# Altium project jtag-isolator.PrjPcb
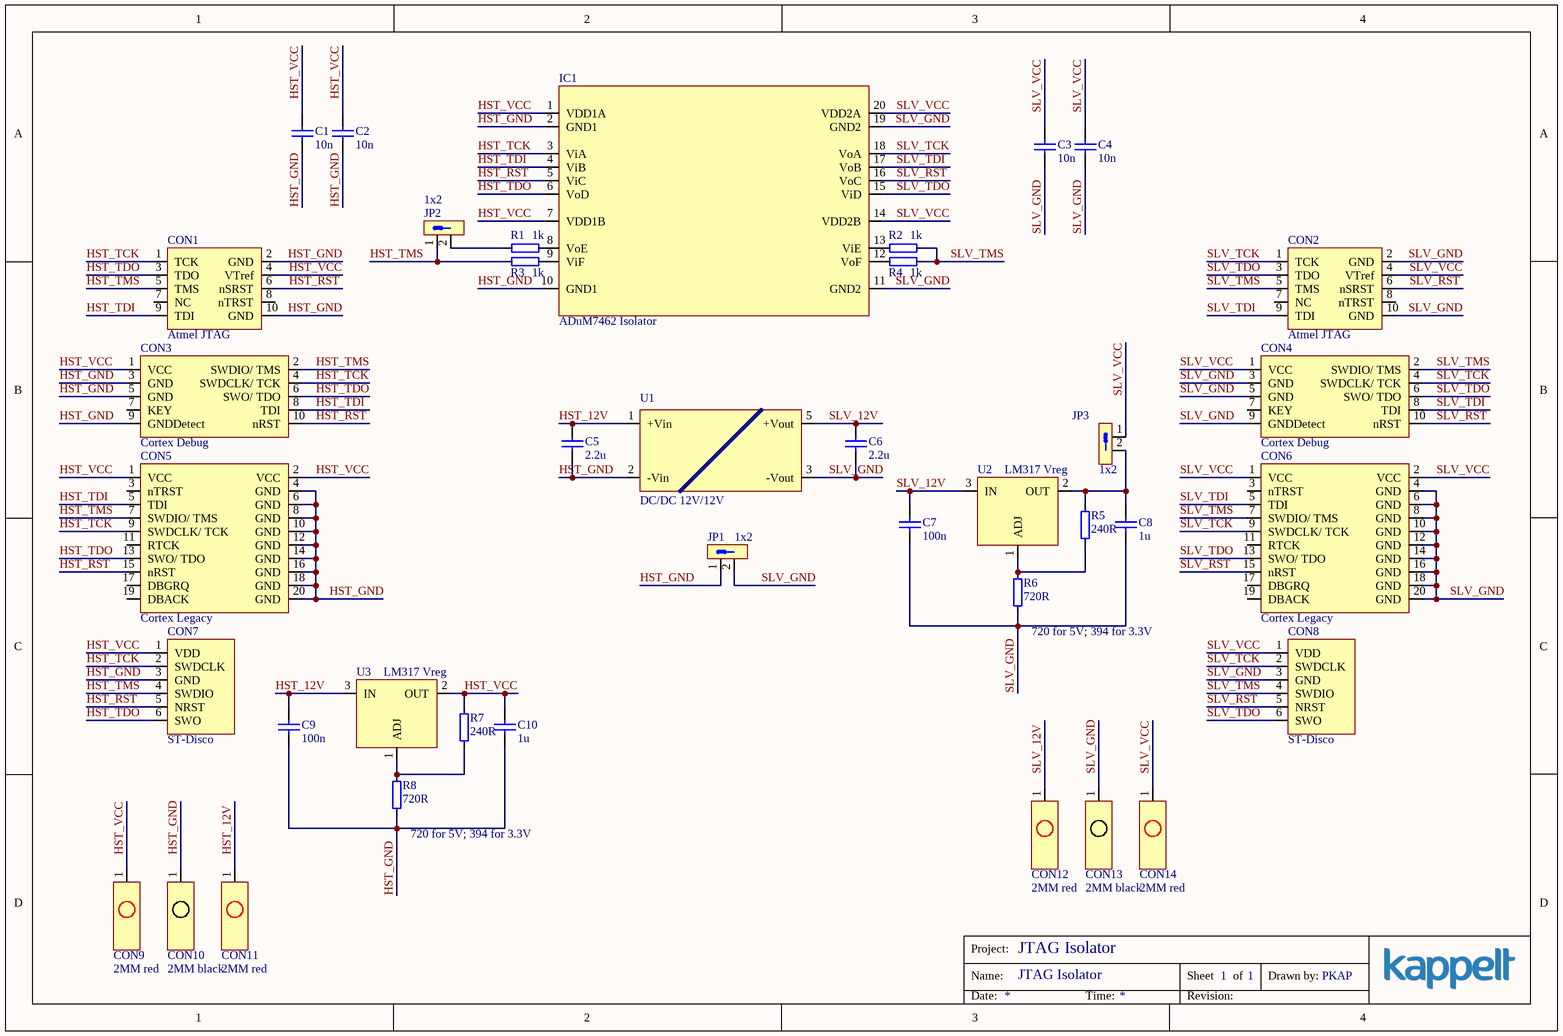
[diagram p0: jtag-isolator.SchDoc]
ProjectName: JTAG Isolator
1 sheet, 39 parts. Net scope: global (net labels, ports and power ports of the same name join across sheets).
Board file: jtag-isolator.PcbDoc

## Sheet jtag-isolator.SchDoc
size A4; DrawnBy: PKAP; SheetNumber: 1; SheetTotal: 1; DocumentName: JTAG Isolator; ProjectName: JTAG Isolator

### Parts
C1  10n  [0603_N]
C2  10n  [0603_N]
C3  10n  [0603_N]
C4  10n  [0603_N]
C5  2.2u  [0603_N]
C6  2.2u  [0603_N]
C7  100n  [0603_N]
C8  1u  [0603_N]
C9  100n  [0603_N]
C10  1u  [0603_N]
CON1  Atmel JTAG  [Atmel-JTAG]
CON2  Atmel JTAG  [Atmel-JTAG]
CON3  Cortex Debug  [cortex-dbg]
CON4  Cortex Debug  [cortex-dbg]
CON5  Cortex Legacy  [Cortex-Legacy]
CON6  Cortex Legacy  [Cortex-Legacy]
CON7  ST-Disco  [ST-Disco]
CON8  ST-Disco  [ST-Disco]
CON9  2MM red  [MPB1-Red]
CON10  2MM black  [MPB1-Black]
CON11  2MM red  [MPB1-Red]
CON12  2MM red  [MPB1-Red]
CON13  2MM black  [MPB1-Black]
CON14  2MM red  [MPB1-Red]
IC1  ADuM7462 Isolator  [ADUM7462-QSOP20]
JP1  1x2  [Header_254_1x2_male]
JP2  1x2  [Header_254_1x2_male]
JP3  1x2  [Header_254_1x2_male]
R1  1k  [0603_N]
R2  1k  [0603_N]
R3  1k  [0603_N]
R4  1k  [0603_N]
R5  240R  [0603_N]
R6  720R  [0603_N]
R7  240R  [0603_N]
R8  720R  [0603_N]
U1  DC/DC 12V/12V  [TMA-1212S]
U2  LM317 Vreg  [LM317-SOT223]
U3  LM317 Vreg  [LM317-SOT223]

### Nets
HST_12V: C5.2 C9.2 CON11.1 U1.1(+Vin) U3.3(IN)
HST_GND: C1.1 C2.1 C5.1 C9.1 C10.1 CON1.2(GND) CON1.10(GND) CON3.3(GND) CON3.5(GND) CON3.9(GNDDetect) CON5.4(GND) CON5.6(GND) CON5.8(GND) CON5.10(GND) CON5.12(GND) CON5.14(GND) CON5.16(GND) CON5.18(GND) CON5.20(GND) CON7.3(GND) CON10.1 IC1.2(GND1) IC1.10(GND1) JP1.1 R8.2 U1.2(-Vin)
HST_RST: CON1.6(nSRST) CON3.10(nRST) CON5.15(nRST) CON7.5(NRST) IC1.5(ViC)
HST_TCK: CON1.1(TCK) CON3.4(SWDCLK/_TCK) CON5.9(SWDCLK/_TCK) CON7.2(SWDCLK) IC1.3(ViA)
HST_TDI: CON1.9(TDI) CON3.8(TDI) CON5.5(TDI) IC1.4(ViB)
HST_TDO: CON1.3(TDO) CON3.6(SWO/_TDO) CON5.13(SWO/_TDO) CON7.6(SWO) IC1.6(VoD)
HST_TMS: CON1.5(TMS) CON3.2(SWDIO/_TMS) CON5.7(SWDIO/_TMS) CON7.4(SWDIO) JP2.1 R3.2
HST_VCC: C1.2 C2.2 C10.2 CON1.4(VTref) CON3.1(VCC) CON5.1(VCC) CON5.2(VCC) CON7.1(VDD) CON9.1 IC1.1(VDD1A) IC1.7(VDD1B) R7.1 U3.2(OUT)
SLV_12V: C6.2 C7.2 CON12.1 U1.5(+Vout) U2.3(IN)
SLV_GND: C3.1 C4.1 C6.1 C7.1 C8.1 CON2.2(GND) CON2.10(GND) CON4.3(GND) CON4.5(GND) CON4.9(GNDDetect) CON6.4(GND) CON6.6(GND) CON6.8(GND) CON6.10(GND) CON6.12(GND) CON6.14(GND) CON6.16(GND) CON6.18(GND) CON6.20(GND) CON8.3(GND) CON13.1 IC1.11(GND2) IC1.19(GND2) JP1.2 R6.2 U1.3(-Vout)
SLV_RST: CON2.6(nSRST) CON4.10(nRST) CON6.15(nRST) CON8.5(NRST) IC1.16(VoC)
SLV_TCK: CON2.1(TCK) CON4.4(SWDCLK/_TCK) CON6.9(SWDCLK/_TCK) CON8.2(SWDCLK) IC1.18(VoA)
SLV_TDI: CON2.9(TDI) CON4.8(TDI) CON6.5(TDI) IC1.17(VoB)
SLV_TDO: CON2.3(TDO) CON4.6(SWO/_TDO) CON6.13(SWO/_TDO) CON8.6(SWO) IC1.15(ViD)
SLV_TMS: CON2.5(TMS) CON4.2(SWDIO/_TMS) CON6.7(SWDIO/_TMS) CON8.4(SWDIO) R2.1 R4.1
SLV_VCC: C3.2 C4.2 CON2.4(VTref) CON4.1(VCC) CON6.1(VCC) CON6.2(VCC) CON8.1(VDD) CON14.1 IC1.14(VDD2B) IC1.20(VDD2A) JP3.1
NetC8_2: C8.2 JP3.2 R5.1 U2.2(OUT)
NetIC1_8: IC1.8(VoE) R1.1
NetIC1_9: IC1.9(ViF) R3.1
NetIC1_12: IC1.12(VoF) R4.2
NetIC1_13: IC1.13(ViE) R2.2
NetJP2_2: JP2.2 R1.2
NetR5_2: R5.2 R6.1 U2.1(ADJ)
NetR7_2: R7.2 R8.1 U3.1(ADJ)

Not connected (* = marked no-connect by the designer): CON1 7(NC) 8(nTRST); CON2 7(NC) 8(nTRST); CON3 7(KEY); CON4 7(KEY); CON5 3(nTRST) 11(RTCK) 17(DBGRQ) 19(DBACK); CON6 3(nTRST) 11(RTCK) 17(DBGRQ) 19(DBACK)

### Notes on the sheet
- (near R6) 720 for 5V; 394 for 3.3V
- (near R8) 720 for 5V; 394 for 3.3V
- Project:
- Name:
- Sheet
- of
- Drawn by:
- Date:
- Time:
- Revision:

### Library data of the parts
C1-C4 = 10n_50V_0603: 10n 50V 0603; part_id: 1100021; MID: std; accuracy: 10.00%; Part Number: 10n_50V_0603; Category: _0603; Sch_Comment: 10n; PID: std; Value: 10n; voltage_rate: 50V
C5 C6 = 2u2_25V_0603: 2u2 25V 0603; part_id: 1100032; MID: std; accuracy: 10.00%; Part Number: 2u2_25V_0603; Category: _0603; Sch_Comment: 2.2u; PID: std; Value: 2.2u; voltage_rate: 25V
C7 C9 = 100n_50V_0603: 100n 50V 0603; part_id: 1100026; MID: std; accuracy: 10.00%; Part Number: 100n_50V_0603; Category: _0603; Sch_Comment: 100n; PID: std; Value: 100n; voltage_rate: 50V
C8 C10 = 1u_50V_0603: 1u 50V 0603; part_id: 1100031; MID: std; accuracy: 10.00%; Part Number: 1u_50V_0603; Category: _0603; Sch_Comment: 1u; PID: std; Value: 1u; voltage_rate: 50V
CON1 CON2 = Atmel-JTAG: Atmel JTAG Connector
CON3 CON4 = Cortex-DBG: MID: Samtec; PID: FTSH-105-01-L-DV-K
CON5 CON6 = Cortex-Legacy
CON7 CON8 = ST-Disco-SWD: STM Discovery Board JTAG Connector
CON9 CON11 CON12 CON14 = 2MM-Red: 2MM test connector; MID: Hirschmann; PID: 930224101
CON10 CON13 = 2MM-Black: 2MM test connector; MID: Hirschmann; PID: 930224100
IC1 = ADuM7642: 1 kV RMS Six-Channel Digital Isolators; MID: Analog Devices; PID: ADuM7462ARQZ/CRQZ
JP1-JP3 = Header_1x02_male: Male Connector 1x2; part_id: 1201102; MID: std; current_rate: 2A; voltage_rate: 100V; Row Count: 1; Column Count: 2; Pitch: 2.54mm; Part Number: Header_1x02_male; Sch_Comment: 1x2; PID: std; Pin Count: 2
R1-R4 = 1k_100mW_0603: 1k 100mW 0603; part_id: 1000038; MID: std; voltage_rate: 50V; accuracy: 5.00%; Part Number: 1k_100mW_0603; Category: _0603; Sch_Comment: 1k; PID: std; Value: 1k; power_rate: 100mW
R5 R7 = 220R_100mW_0603: 240R 100mW 0603; Part Number: 240R_100mW_0603; voltage_rate: 50V; accuracy: 5.00%; Category: _0603; Sch_Comment: 240R; Value: 240R; power_rate: 100mW
R6 R8 = 680R_100mW_0603: 720R 100mW 0603; Part Number: 720R_100mW_0603; voltage_rate: 50V; accuracy: 5.00%; Category: _0603; Sch_Comment: 720R; Value: 720R; power_rate: 100mW
U1 = TMA-1212S: Isolierter DC/DC-Wandler f. PCB-Montage, Fest, 1 Ausgang, 10.8 V, 13.2 V, 1 W, 12 V; MID: Tracopower; PID: TMA 1212S
U2 U3 = LM317DCY: Linear Voltage Regulator, Adjustable, 40V primary input, 1.25V to 37V/1.5A/1 Output, SOT-223-4; MID: Texas Instruments; PID: LM317DCY